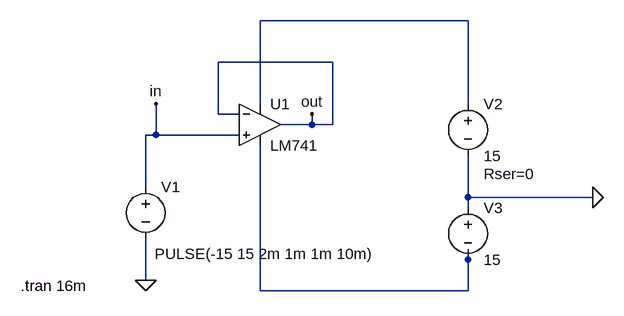
[diagram p0: schematic LM741voltageFollower.asc]
LM741voltageFollower.asc, the LTspice schematic file:
Version 4
SHEET 1 880 680
WIRE 512 -16 192 -16
WIRE 304 48 128 48
WIRE 192 112 192 -16
WIRE 512 112 512 -16
WIRE 128 128 128 48
WIRE 160 128 128 128
WIRE 272 144 272 128
WIRE 272 144 224 144
WIRE 304 144 304 48
WIRE 304 144 272 144
WIRE 32 160 32 112
WIRE 32 160 16 160
WIRE 160 160 32 160
WIRE 16 240 16 160
WIRE 512 256 512 192
WIRE 704 256 512 256
WIRE 512 272 512 256
WIRE 512 352 512 336
WIRE 16 384 16 320
WIRE 192 400 192 176
WIRE 512 400 512 352
WIRE 512 400 192 400
FLAG 16 384 0
FLAG 32 112 in
FLAG 272 128 out
FLAG 704 256 0
SYMBOL LM741 192 80 R0
SYMATTR InstName U1
SYMBOL voltage 512 96 R0
WINDOW 123 0 0 Left 0
WINDOW 39 24 124 Left 2
SYMATTR SpiceLine Rser=0
SYMATTR InstName V2
SYMATTR Value 15
SYMBOL voltage 16 224 R0
WINDOW 3 14 119 Left 2
WINDOW 123 0 0 Left 0
WINDOW 39 0 0 Left 0
SYMATTR Value PULSE(-15 15 2m 1m 1m 10m)
SYMATTR InstName V1
SYMBOL voltage 512 256 R0
WINDOW 123 0 0 Left 0
WINDOW 39 0 0 Left 0
SYMATTR InstName V3
SYMATTR Value 15
TEXT -176 392 Left 2 !.tran 16m

The netlist it stands for:
* LM741voltageFollower.asc
XU1 in out N001 N002 out LM741  ; pins In+ In- V+ V- OUT
V2 N001 0 15 Rser=0
V1 in 0 PULSE(-15 15 2m 1m 1m 10m)
V3 0 N002 15
.tran 16m
.lib LM741.lib
.backanno
.end